# Altium schematic sheet Power Supply.schdoc: Power Supply
size A4; Organization: Altium Limited; Address1: L3, 12a Rodborough Rd; Address2: Frenchs Forest; Address3: NSW; Address4: Australia 2086; DocumentNumber: 1; SheetNumber: 1; SheetTotal: 1
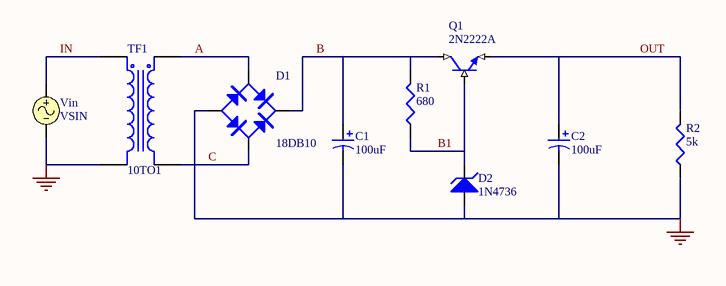
[diagram p0: Power Supply.schdoc]

## Parts
C1  100uF
C2  100uF
D1  18DB10
D2  1N4736
Q1  2N2222A
R1  680
R2  5k
TF1  10TO1
Vin  VSIN

## Nets
GND: C1.2 C2.2 D1.1(V-) D2.1(A) R2.2(BOT) TF1.2(Pri-) Vin.2
A: D1.2(AC) TF1.3(Sec+)
B: C1.1 D1.3(V+) Q1.1(C) R1.1(TOP)
B1: D2.2(K) Q1.2(B) R1.2(BOT)
C: D1.4(AC) TF1.4(Sec-)
IN: TF1.1(Pri+) Vin.1
OUT: C2.1 Q1.3(E) R2.1(TOP)

## Notes on the sheet
- Title
- Size:
- Date:
- A4
- Number:
- Time:
- Revision:
- Sheet
- of
- File:

## Library data of the parts
C1 C2 = CAP2: Bi-Polar Capacitor; Value: 100uF
D1 = 18DB10: Diode Bridge
D2 = 1N4736: Zener Diode
Q1 = 2N2222A: NPN BJT
R1 R2 = RES: Resistor
  R1: Value: 680
  R2: Value: 5k
TF1 = 10TO1: Transformer
Vin = VSIN: Sinusoidal Voltage Source